# Altium schematic sheet XTX.SchDoc
size C; DocumentNumber: 3; SheetNumber: 3; SheetTotal: 8
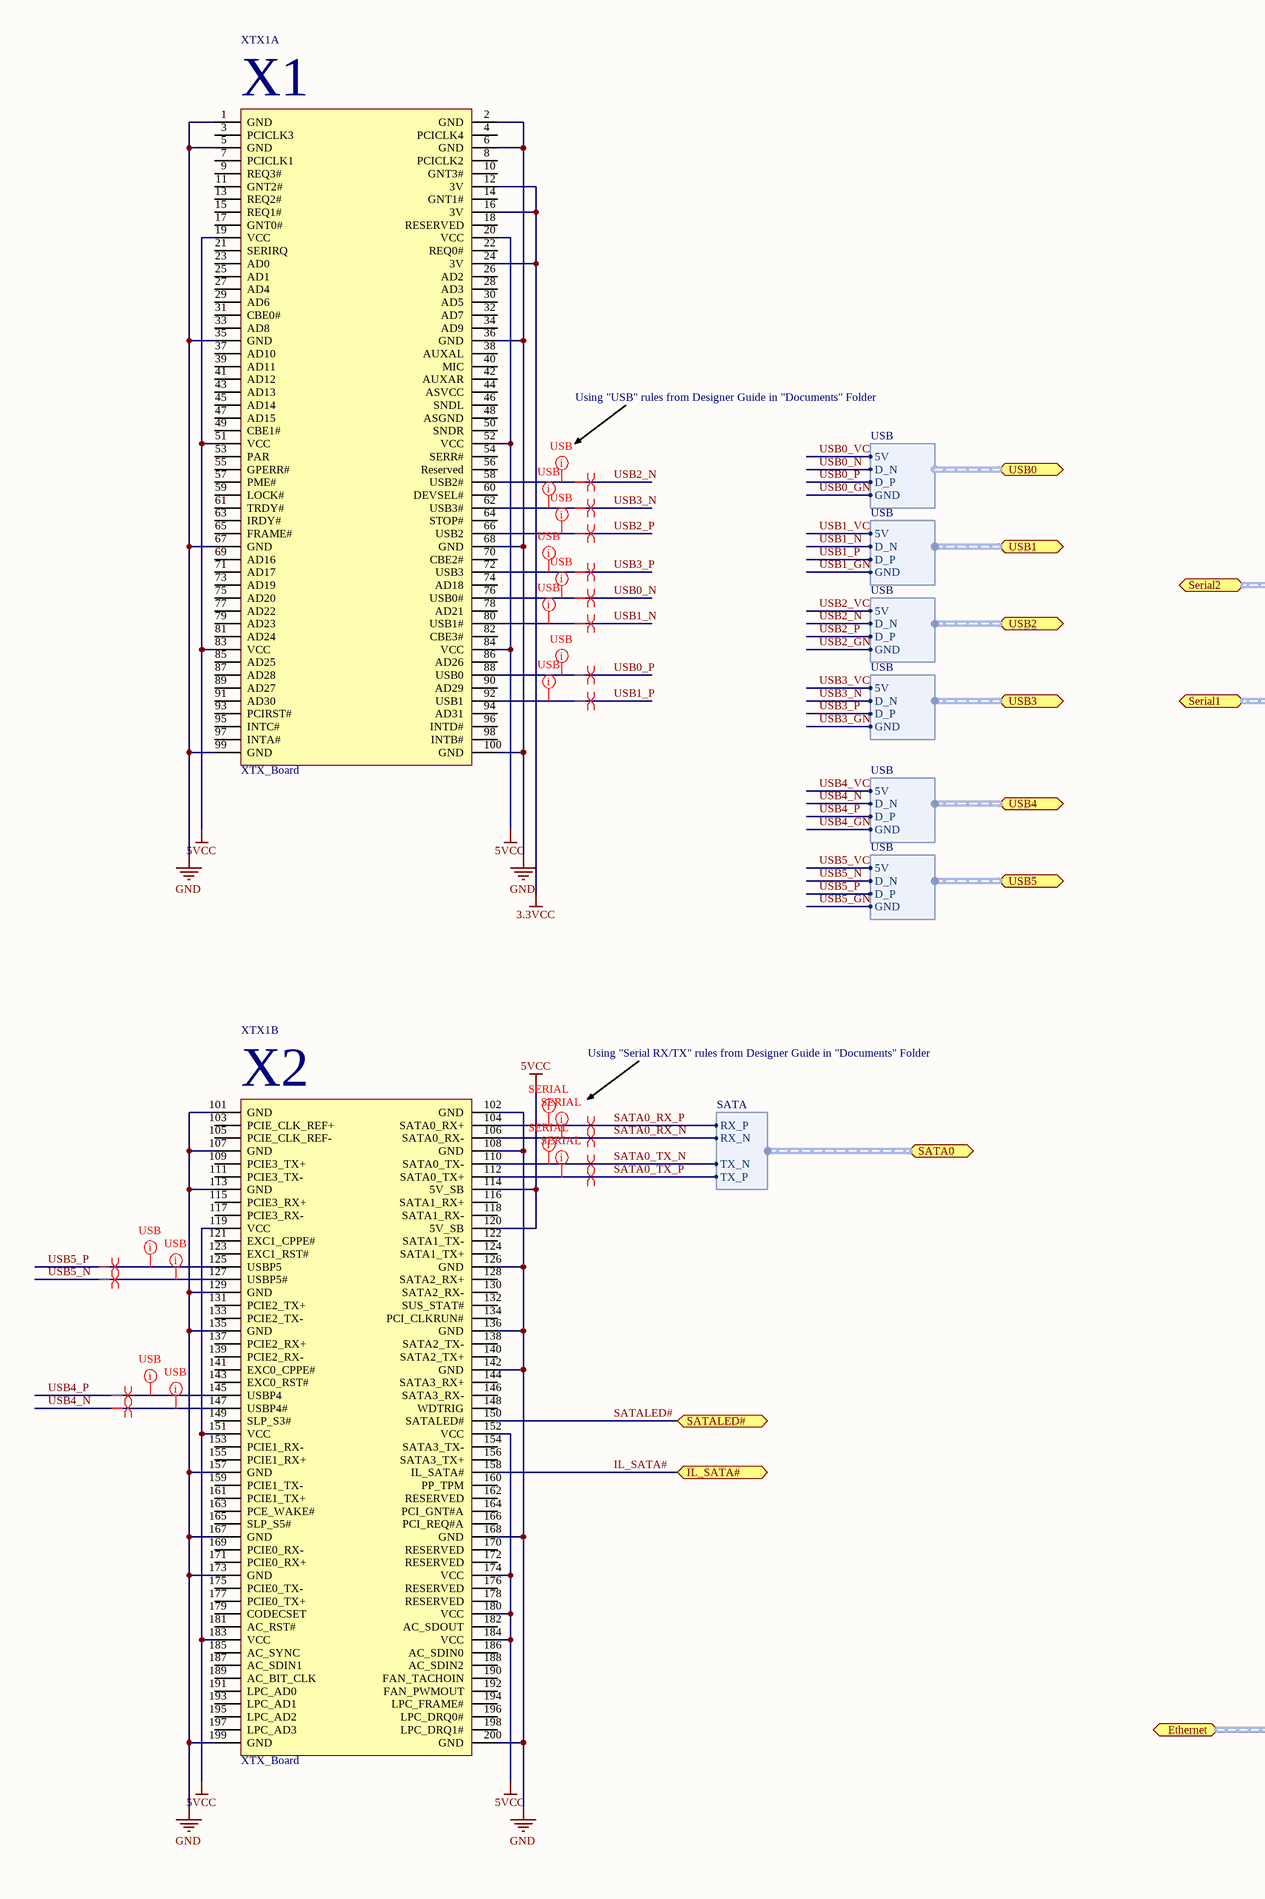
[diagram p0: XTX.SchDoc, left]
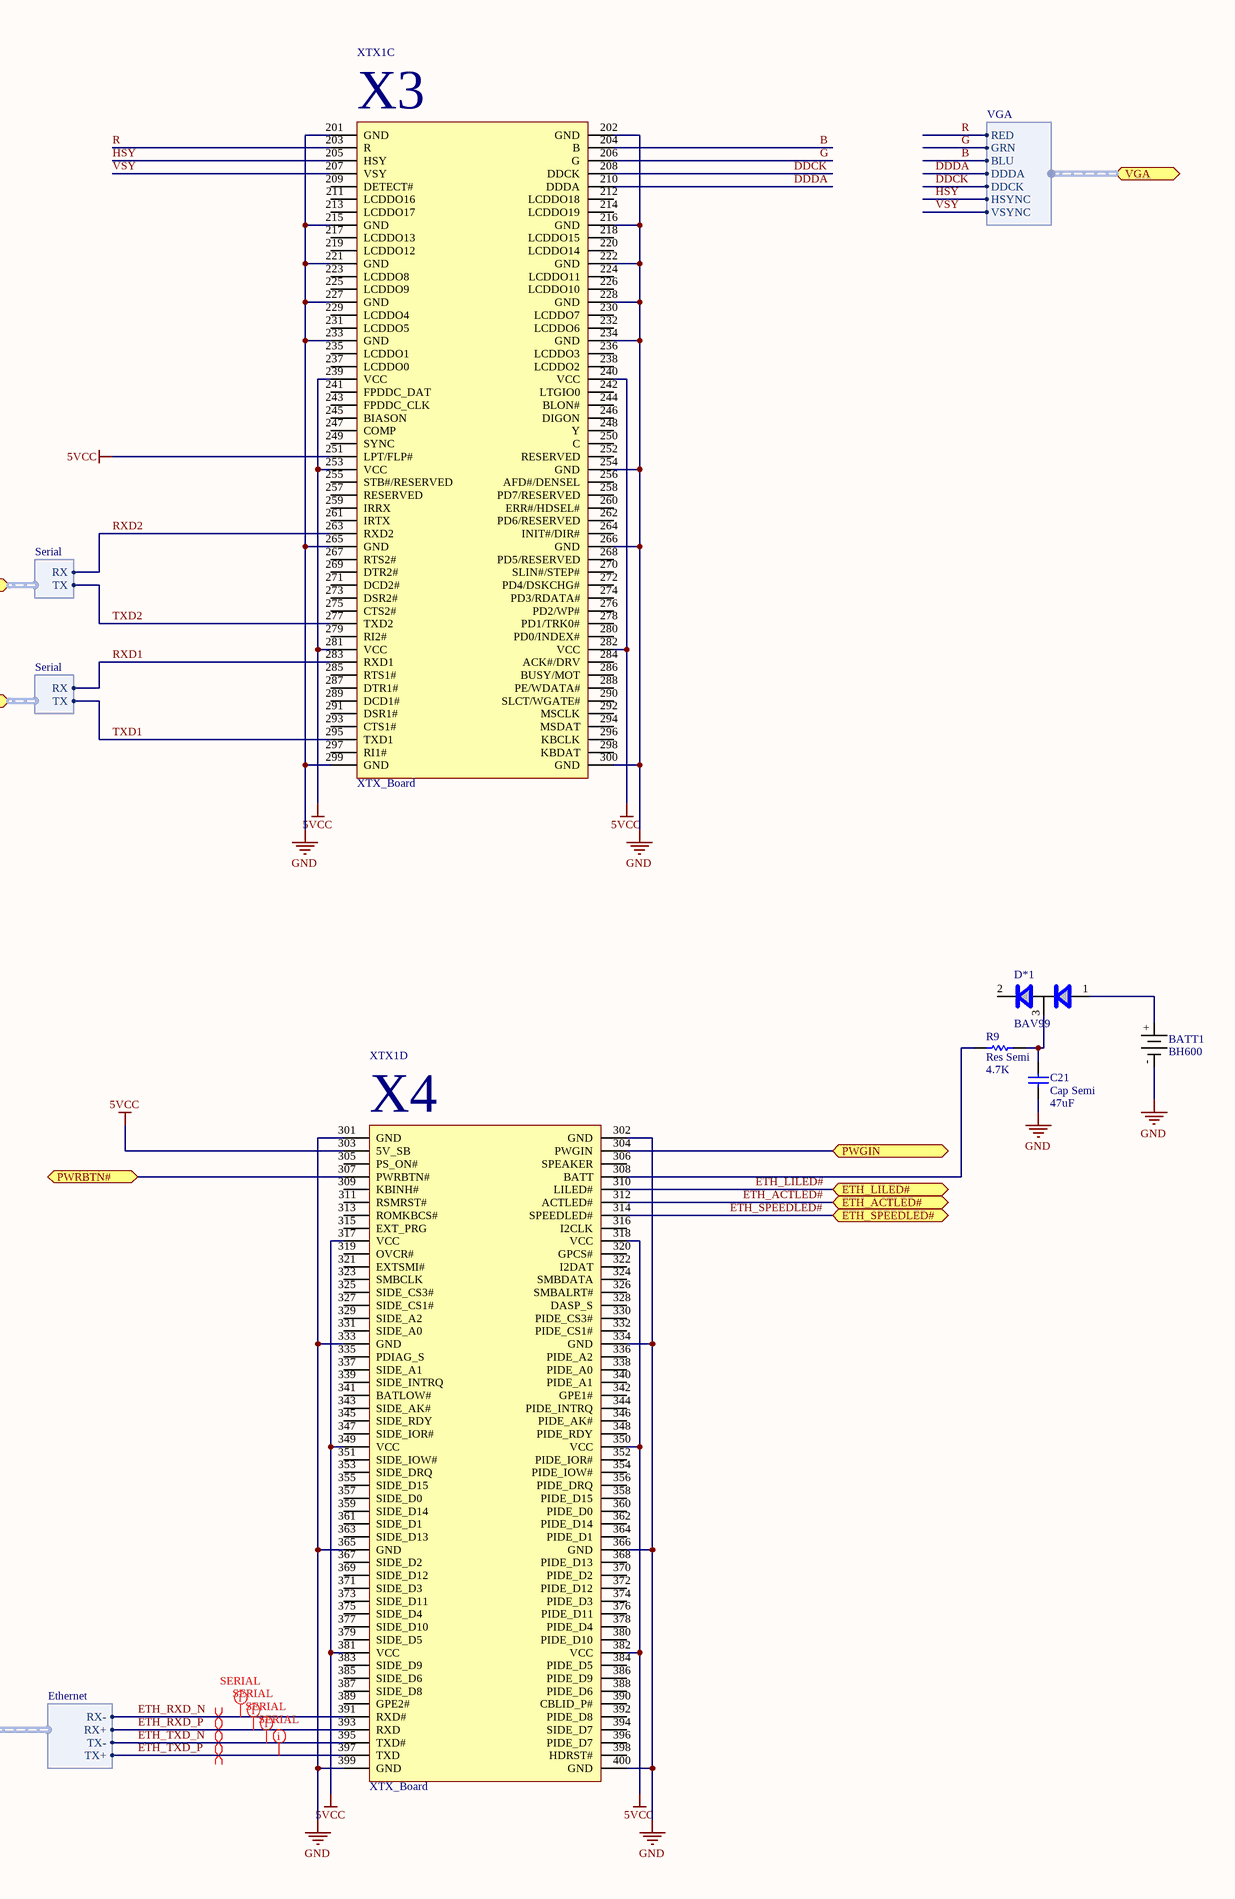
[diagram p1: XTX.SchDoc, right]

## Parts
BATT1  BH600  [BH600]
C21  Cap Semi  value 47uF  [1210 (3225) Capacitor]
D*1  BAV99  [SOT-23]
R9  Res Semi  value 4.7K  [1005[0402]]
XTX1  XTX_Board  [XTX_Board]  (parts A,B,C,D of 4)

## Ports
ETH_ACTLED#, ETH_LILED#, ETH_SPEEDLED#, Ethernet (harness Ethernet), IL_SATA#, PWGIN, PWRBTN#, SATA0 (harness SATA), SATALED#, Serial1 (harness Serial), Serial2 (harness Serial), USB0 (harness USB), USB1 (harness USB), USB2 (harness USB), USB3 (harness USB), USB4 (harness USB), USB5 (harness USB), VGA (harness VGA)

## Harnesses
Ethernet: RX-, RX+, TX-, TX+
USB: 5V, D_N, D_P, GND
Serial: RX, TX
VGA: RED, GRN, BLU, HSYNC, VSYNC, DDCK, DDDA
SATA: TX_P, TX_N, RX_N, RX_P

## Nets
3.3VCC: XTX1.12(3V) XTX1.16(3V) XTX1.24(3V)
5VCC: XTX1.19(VCC) XTX1.20(VCC) XTX1.51(VCC) XTX1.52(VCC) XTX1.83(VCC) XTX1.84(VCC) XTX1.114(5V_SB) XTX1.119(VCC) XTX1.120(5V_SB) XTX1.151(VCC) XTX1.152(VCC) XTX1.174(VCC) XTX1.180(VCC) XTX1.183(VCC) XTX1.184(VCC) XTX1.239(VCC) XTX1.240(VCC) XTX1.251(LPT/FLP#) XTX1.253(VCC) XTX1.281(VCC) XTX1.282(VCC) XTX1.303(5V_SB) XTX1.317(VCC) XTX1.318(VCC) XTX1.349(VCC) XTX1.350(VCC) XTX1.381(VCC) XTX1.382(VCC)
GND: BATT1.- C21.1 XTX1.1(GND) XTX1.2(GND) XTX1.5(GND) XTX1.6(GND) XTX1.35(GND) XTX1.36(GND) XTX1.67(GND) XTX1.68(GND) XTX1.99(GND) XTX1.100(GND) XTX1.101(GND) XTX1.102(GND) XTX1.107(GND) XTX1.108(GND) XTX1.113(GND) XTX1.126(GND) XTX1.129(GND) XTX1.135(GND) XTX1.136(GND) XTX1.142(GND) XTX1.157(GND) XTX1.167(GND) XTX1.168(GND) XTX1.173(GND) XTX1.199(GND) XTX1.200(GND) XTX1.201(GND) XTX1.202(GND) XTX1.215(GND) XTX1.216(GND) XTX1.221(GND) XTX1.222(GND) XTX1.227(GND) XTX1.228(GND) XTX1.233(GND) XTX1.234(GND) XTX1.254(GND) XTX1.265(GND) XTX1.266(GND) XTX1.299(GND) XTX1.300(GND) XTX1.301(GND) XTX1.302(GND) XTX1.333(GND) XTX1.334(GND) XTX1.365(GND) XTX1.366(GND) XTX1.399(GND) XTX1.400(GND)
B: XTX1.204(B) ; port VGA.BLU
DDCK: XTX1.208(DDCK) ; port VGA.DDCK
DDDA: XTX1.210(DDDA) ; port VGA.DDDA
ETH_ACTLED#: XTX1.312(ACTLED#) ; port ETH_ACTLED#
ETH_LILED#: XTX1.310(LILED#) ; port ETH_LILED#
ETH_RXD_N: XTX1.391(RXD#) ; port Ethernet.RX-
ETH_RXD_P: XTX1.393(RXD) ; port Ethernet.RX+
ETH_SPEEDLED#: XTX1.314(SPEEDLED#) ; port ETH_SPEEDLED#
ETH_TXD_N: XTX1.395(TXD#) ; port Ethernet.TX-
ETH_TXD_P: XTX1.397(TXD) ; port Ethernet.TX+
G: XTX1.206(G) ; port VGA.GRN
HSY: XTX1.205(HSY) ; port VGA.HSYNC
IL_SATA#: XTX1.158(IL_SATA#) ; port IL_SATA#
PWGIN: XTX1.304(PWGIN) ; port PWGIN
PWRBTN#: XTX1.307(PWRBTN#) ; port PWRBTN#
R: XTX1.203(R) ; port VGA.RED
RXD1: XTX1.283(RXD1) ; port Serial1.RX
RXD2: XTX1.263(RXD2) ; port Serial2.RX
SATA0_RX_N: XTX1.106(SATA0_RX-) ; port SATA0.RX_N
SATA0_RX_P: XTX1.104(SATA0_RX+) ; port SATA0.RX_P
SATA0_TX_N: XTX1.110(SATA0_TX-) ; port SATA0.TX_N
SATA0_TX_P: XTX1.112(SATA0_TX+) ; port SATA0.TX_P
SATALED#: XTX1.150(SATALED#) ; port SATALED#
TXD1: XTX1.295(TXD1) ; port Serial1.TX
TXD2: XTX1.277(TXD2) ; port Serial2.TX
USB0_GND: port USB0.GND
USB0_N: XTX1.76(USB0#) ; port USB0.D_N
USB0_P: XTX1.88(USB0) ; port USB0.D_P
USB0_VCC: port USB0.5V
USB1_GND: port USB1.GND
USB1_N: XTX1.80(USB1#) ; port USB1.D_N
USB1_P: XTX1.92(USB1) ; port USB1.D_P
USB1_VCC: port USB1.5V
USB2_GND: port USB2.GND
USB2_N: XTX1.58(USB2#) ; port USB2.D_N
USB2_P: XTX1.66(USB2) ; port USB2.D_P
USB2_VCC: port USB2.5V
USB3_GND: port USB3.GND
USB3_N: XTX1.62(USB3#) ; port USB3.D_N
USB3_P: XTX1.72(USB3) ; port USB3.D_P
USB3_VCC: port USB3.5V
USB4_GND: port USB4.GND
USB4_N: XTX1.147(USBP4#) ; port USB4.D_N
USB4_P: XTX1.145(USBP4) ; port USB4.D_P
USB4_VCC: port USB4.5V
USB5_GND: port USB5.GND
USB5_N: XTX1.127(USBP5#) ; port USB5.D_N
USB5_P: XTX1.125(USBP5) ; port USB5.D_P
USB5_VCC: port USB5.5V
VSY: XTX1.207(VSY) ; port VGA.VSYNC
NetBATT1_+: BATT1.+ D*1.1
NetC21_2: C21.2 D*1.3 R9.2
NetR9_1: R9.1 XTX1.308(BATT)

Not connected (* = marked no-connect by the designer): D*1 2; XTX1 3(PCICLK3) 4(PCICLK4) 7(PCICLK1) 8(PCICLK2) 9(REQ3#) 10(GNT3#) 11(GNT2#) 13(REQ2#) 14(GNT1#) 15(REQ1#) 17(GNT0#) 18(RESERVED) 21(SERIRQ) 22(REQ0#) 23(AD0) 25(AD1) 26(AD2) 27(AD4) 28(AD3) 29(AD6) 30(AD5) 31(CBE0#) 32(AD7) 33(AD8) 34(AD9) 37(AD10) 38(AUXAL) 39(AD11) 40(MIC) 41(AD12) 42(AUXAR) 43(AD13) 44(ASVCC) 45(AD14) 46(SNDL) 47(AD15) 48(ASGND) 49(CBE1#) 50(SNDR) 53(PAR) 54(SERR#) 55(GPERR#) 56(Reserved) 57(PME#) 59(LOCK#) 60(DEVSEL#) 61(TRDY#) 63(IRDY#) 64(STOP#) 65(FRAME#) 69(AD16) 70(CBE2#) 71(AD17) 73(AD19) 74(AD18) 75(AD20) 77(AD22) 78(AD21) 79(AD23) 81(AD24) 82(CBE3#) 85(AD25) 86(AD26) 87(AD28) 89(AD27) 90(AD29) 91(AD30) 93(PCIRST#) 94(AD31) 95(INTC#) 96(INTD#) 97(INTA#) 98(INTB#) 103(PCIE_CLK_REF+) 105(PCIE_CLK_REF-) 109(PCIE3_TX+) 111(PCIE3_TX-) 115(PCIE3_RX+) 116(SATA1_RX+) 117(PCIE3_RX-) 118(SATA1_RX-) 121(EXC1_CPPE#) 122(SATA1_TX-) 123(EXC1_RST#) 124(SATA1_TX+) 128(SATA2_RX+) 130(SATA2_RX-) 131(PCIE2_TX+) 132(SUS_STAT#) 133(PCIE2_TX-) 134(PCI_CLKRUN#) 137(PCIE2_RX+) 138(SATA2_TX-) 139(PCIE2_RX-) 140(SATA2_TX+) 141(EXC0_CPPE#) 143(EXC0_RST#) 144(SATA3_RX+) 146(SATA3_RX-) 148(WDTRIG) 149(SLP_S3#) 153(PCIE1_RX-) 154(SATA3_TX-) 155(PCIE1_RX+) 156(SATA3_TX+) 159(PCIE1_TX-) 160(PP_TPM) 161(PCIE1_TX+) 162(RESERVED) 163(PCE_WAKE#) 164(PCI_GNT#A) 165(SLP_S5#) 166(PCI_REQ#A) 169(PCIE0_RX-) 170(RESERVED) 171(PCIE0_RX+) 172(RESERVED) 175(PCIE0_TX-) 176(RESERVED) 177(PCIE0_TX+) 178(RESERVED) 179(CODECSET) 181(AC_RST#) 182(AC_SDOUT) 185(AC_SYNC) 186(AC_SDIN0) 187(AC_SDIN1) 188(AC_SDIN2) 189(AC_BIT_CLK) 190(FAN_TACHOIN) 191(LPC_AD0) 192(FAN_PWMOUT) 193(LPC_AD1) 194(LPC_FRAME#) 195(LPC_AD2) 196(LPC_DRQ0#) 197(LPC_AD3) 198(LPC_DRQ1#) 209(DETECT#) 211(LCDDO16) 212(LCDDO18) 213(LCDDO17) 214(LCDDO19) 217(LCDDO13) 218(LCDDO15) 219(LCDDO12) 220(LCDDO14) 223(LCDDO8) 224(LCDDO11) 225(LCDDO9) 226(LCDDO10) 229(LCDDO4) 230(LCDDO7) 231(LCDDO5) 232(LCDDO6) 235(LCDDO1) 236(LCDDO3) 237(LCDDO0) 238(LCDDO2) 241(FPDDC_DAT) 242(LTGIO0) 243(FPDDC_CLK) 244(BLON#) 245(BIASON) 246(DIGON) 247(COMP) 248(Y) 249(SYNC) 250(C) 252(RESERVED) 255(STB#/RESERVED) 256(AFD#/DENSEL) 257(RESERVED) 258(PD7/RESERVED) 259(IRRX) 260(ERR#/HDSEL#) 261(IRTX) 262(PD6/RESERVED) 264(INIT#/DIR#) 267(RTS2#) 268(PD5/RESERVED) 269(DTR2#) 270(SLIN#/STEP#) 271(DCD2#) 272(PD4/DSKCHG#) 273(DSR2#) 274(PD3/RDATA#) 275(CTS2#) 276(PD2/WP#) 278(PD1/TRK0#) 279(RI2#) 280(PD0/INDEX#) 284(ACK#/DRV) 285(RTS1#) 286(BUSY/MOT) 287(DTR1#) 288(PE/WDATA#) 289(DCD1#) 290(SLCT/WGATE#) 291(DSR1#) 292(MSCLK) 293(CTS1#) 294(MSDAT) 296(KBCLK) 297(RI1#) 298(KBDAT) 305(PS_ON#) 306(SPEAKER) 309(KBINH#) 311(RSMRST#) 313(ROMKBCS#) 315(EXT_PRG) 316(I2CLK) 319(OVCR#) 320(GPCS#) 321(EXTSMI#) 322(I2DAT) 323(SMBCLK) 324(SMBDATA) 325(SIDE_CS3#) 326(SMBALRT#) 327(SIDE_CS1#) 328(DASP_S) 329(SIDE_A2) 330(PIDE_CS3#) 331(SIDE_A0) 332(PIDE_CS1#) 335(PDIAG_S) 336(PIDE_A2) 337(SIDE_A1) 338(PIDE_A0) 339(SIDE_INTRQ) 340(PIDE_A1) 341(BATLOW#) 342(GPE1#) 343(SIDE_AK#) 344(PIDE_INTRQ) 345(SIDE_RDY) 346(PIDE_AK#) 347(SIDE_IOR#) 348(PIDE_RDY) 351(SIDE_IOW#) 352(PIDE_IOR#) 353(SIDE_DRQ) 354(PIDE_IOW#) 355(SIDE_D15) 356(PIDE_DRQ) 357(SIDE_D0) 358(PIDE_D15) 359(SIDE_D14) 360(PIDE_D0) 361(SIDE_D1) 362(PIDE_D14) 363(SIDE_D13) 364(PIDE_D1) 367(SIDE_D2) 368(PIDE_D13) 369(SIDE_D12) 370(PIDE_D2) 371(SIDE_D3) 372(PIDE_D12) 373(SIDE_D11) 374(PIDE_D3) 375(SIDE_D4) 376(PIDE_D11) 377(SIDE_D10) 378(PIDE_D4) 379(SIDE_D5) 380(PIDE_D10) 383(SIDE_D9) 384(PIDE_D5) 385(SIDE_D6) 386(PIDE_D9) 387(SIDE_D8) 388(PIDE_D6) 389(GPE2#) 390(CBLID_P#) 392(PIDE_D8) 394(SIDE_D7) 396(PIDE_D7) 398(HDRST#)

## Layout directives
differential pair: ETH_RXD_N, ETH_RXD_P, ETH_TXD_N, ETH_TXD_P, SATA0_RX_N, SATA0_RX_P, SATA0_TX_N, SATA0_TX_P, USB0_N, USB0_P, USB1_N, USB1_P, USB2_N, USB2_P, USB3_N, USB3_P, USB4_N, USB4_P, USB5_N, USB5_P
rule Width Constraint [Pref Width = 7mil    Min Width = 7mil    Max Width = 7mil]; rule Length Constraint [Min Length = 0mil    Max Length = 18000mil]; rule Differential Pairs Routing [Pref Gap = 5mil    Min Gap  = 5mil    Max Gap  = 5mil]; rule Matched Net Lengths [Tolerance = 200mil]; net class USB: USB0_N, USB0_P, USB1_N, USB1_P, USB2_N, USB2_P, USB3_N, USB3_P, USB4_N, USB4_P, USB5_N, USB5_P
rule Width Constraint [Pref Width = 5mil    Min Width = 5mil    Max Width = 5mil]; rule Length Constraint [Min Length = 0mil    Max Length = 6500mil]; rule Differential Pairs Routing [Pref Gap = 4mil    Min Gap  = 4mil    Max Gap  = 4mil]; rule Matched Net Lengths [Tolerance = 3000mil]; net class USB: ETH_RXD_N, ETH_RXD_P, ETH_TXD_N, ETH_TXD_P, SATA0_RX_N, SATA0_RX_P, SATA0_TX_N, SATA0_TX_P

## Notes on the sheet
- Using "USB" rules from Designer Guide in "Documents" Folder
- Using "Serial RX/TX" rules from Designer Guide in "Documents" Folder
- (in symbol XTX_Board, part A) X1
- (in symbol XTX_Board, part B) X2
- (in symbol XTX_Board, part C) X3
- (in symbol XTX_Board, part D) X4

## Library data of the parts
BATT1 = BH600: 16mm Battery Holder - Memory Protection Devices; Supplier Part Number: BH600-ND; Supplier: Digi-Key
C21 = Cap Semi: Capacitor (Semiconductor SIM Model); Published: 8-Jun-2000; LatestRevisionDate: 17-Jul-2002; LatestRevisionNote: Re-released for DXP Platform.; PackageReference: C1206; Publisher: Altium Limited; Supplier Part Number: 490-1887-1-ND; Supplier: Digi-Key
D*1 = BAV99: Dual Surface Mount Switching Diode; Supplier Part Number: BAV99-FDICT-ND; Supplier: Digi-Key
R9 = Res Semi: Semiconductor Resistor; Published: 8-Jun-2000; LatestRevisionDate: 17-Jul-2002; LatestRevisionNote: Re-released for DXP Platform.; PackageReference: AXIAL-0.5; Publisher: Altium Limited; Supplier Part Number: P4.7KJCT-ND; Supplier: Digi-Key
XTX1 = XTX_Board: Datasheet: http://www.xtx-standard.org/fileadmin/documents/XTX-Spec12.pdf